# EAGLE design OwlRack (EAGLE 7.5.0)
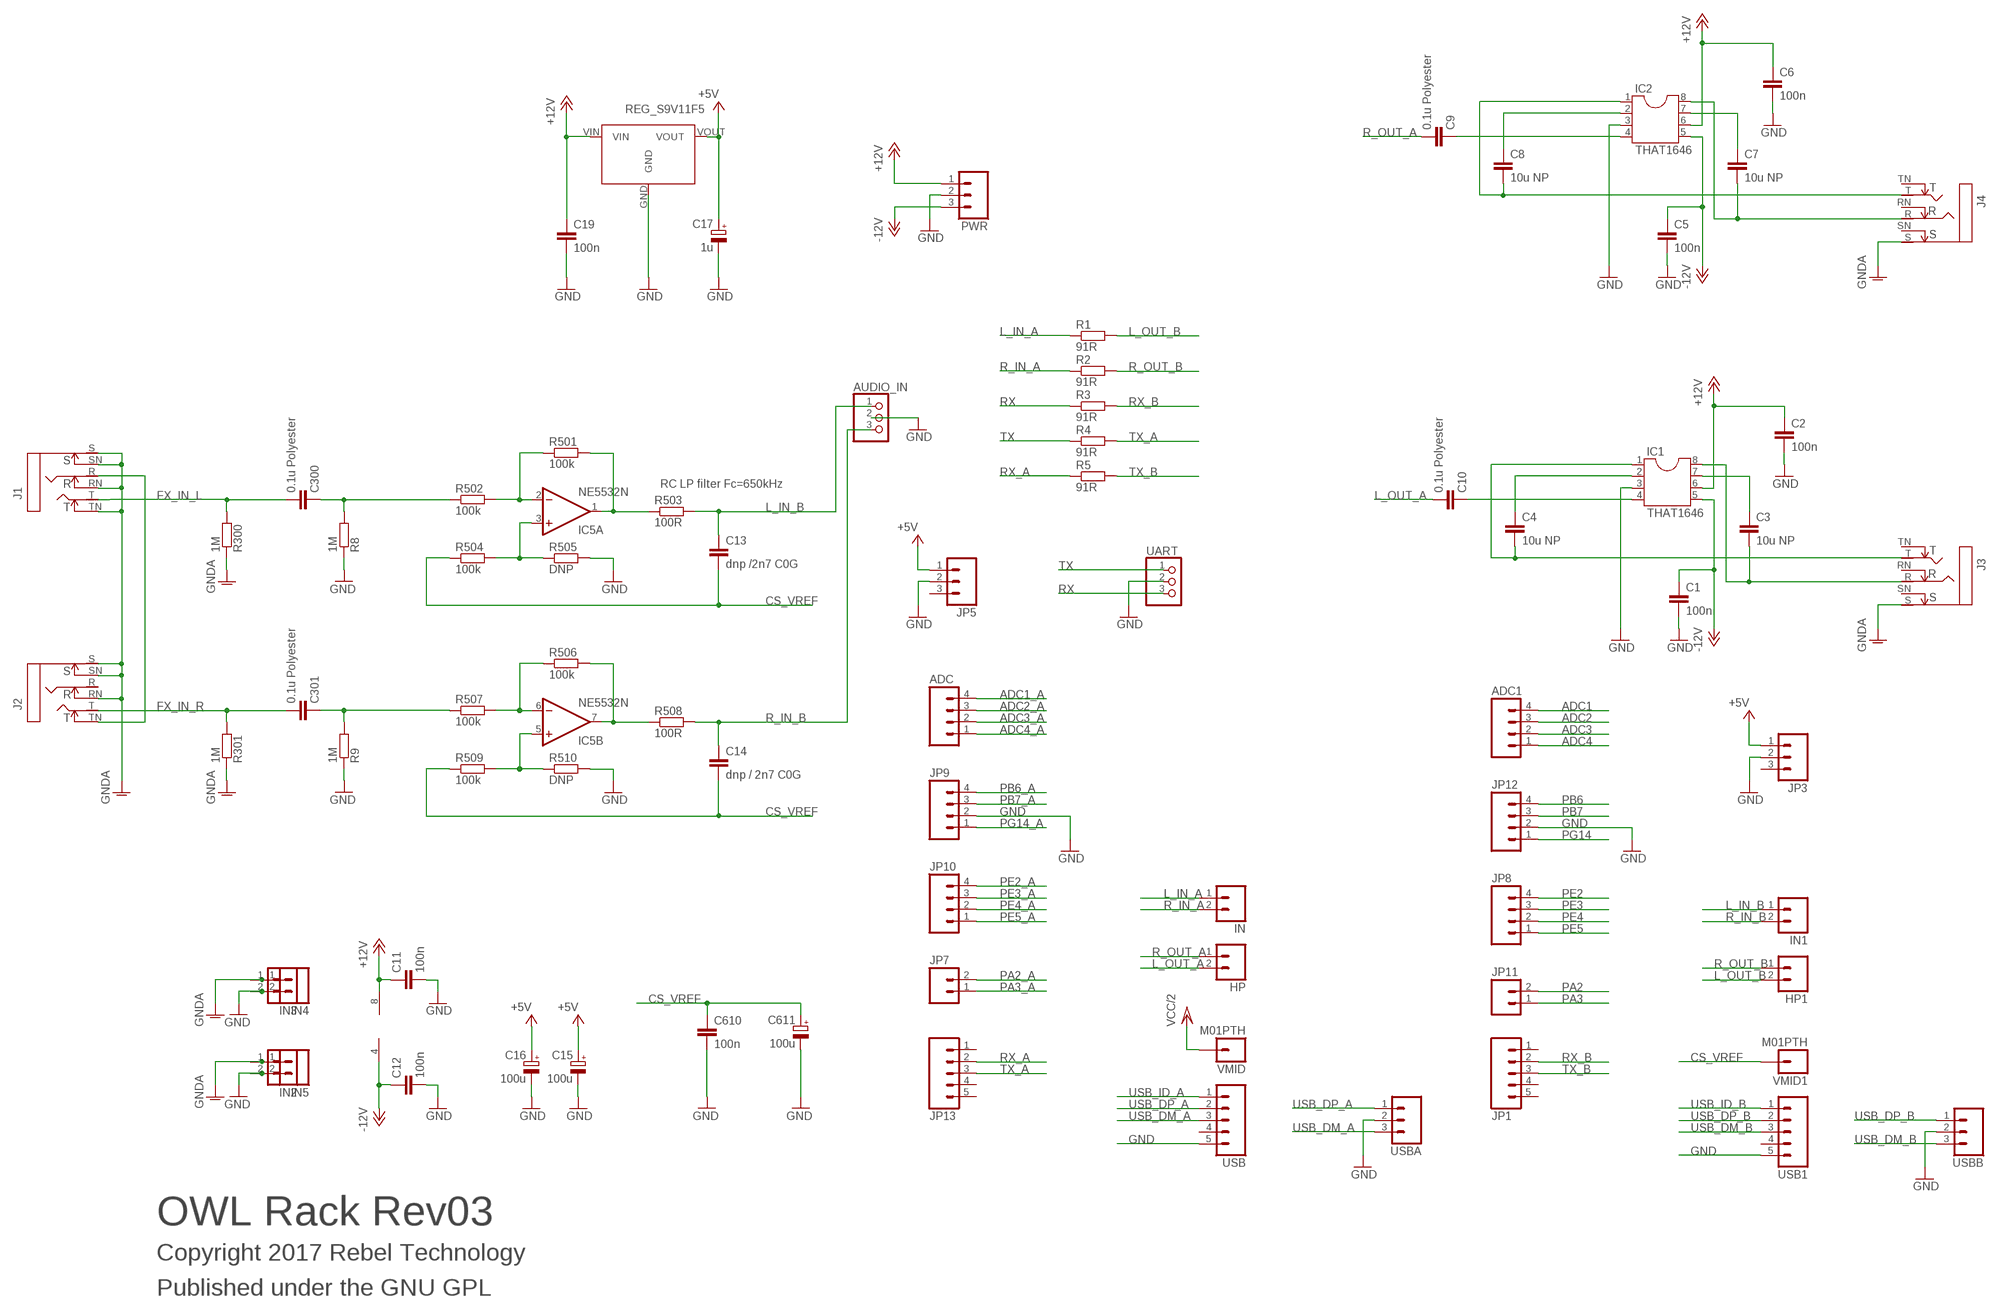
[diagram p0: schematic, sheet 1]

## Parts
ADC  M04PTH  [1X04]
ADC1  M04PTH  [1X04]
AUDIO_IN  CON-JST-1X03PH-TH  [JST-B3B-PH-KL]
C1  100n  C-EU050-025X075  [C050-025X075]
C2  100n  C-EU050-025X075  [C050-025X075]
C3  10u NP  C-EU050-025X075  [C050-025X075]
C4  10u NP  C-EU050-025X075  [C050-025X075]
C5  100n  C-EU050-025X075  [C050-025X075]
C6  100n  C-EU050-025X075  [C050-025X075]
C7  10u NP  C-EU050-025X075  [C050-025X075]
C8  10u NP  C-EU050-025X075  [C050-025X075]
C9  0.1u Polyester  C5/3.5  [C5B3.5]
C10  0.1u Polyester  C5/3.5  [C5B3.5]
C11  100n  C-EU050-025X075  [C050-025X075]
C12  100n  C-EU050-025X075  [C050-025X075]
C13  dnp /2n7 C0G  C-EU050-025X075  [C050-025X075]
C14  dnp / 2n7 C0G  C-EU050-025X075  [C050-025X075]
C15  100u  CPOL-EUE2.5-7  [E2,5-7]
C16  100u  CPOL-EUE2.5-7  [E2,5-7]
C17  1u  CPOL-EUE2.5-7  [E2,5-7]
C19  100n  C-EU050-025X075  [C050-025X075]
C300  0.1u Polyester  C5/3.5  [C5B3.5]
C301  0.1u Polyester  C5/3.5  [C5B3.5]
C610  100n  C-EU050-025X075  [C050-025X075]
C611  100u  CPOL-EUE2.5-7  [E2,5-7]
HP  M02PTH  [1X02]
HP1  M02PTH  [1X02]
IC1  THAT1646  DIL8  [DIL08]
IC2  THAT1646  DIL8  [DIL08]
IC3  REG_S9V11F5  [REG_S9V11F5]
IC5  NE5532N  [DIL08]
IN  M02PTH  [1X02]
IN1  M02PTH  [1X02]
IN2  M02PTH  [1X02]
IN3  M02PTH  [1X02]
IN4  M02PTH  [1X02]
IN5  M02PTH  [1X02]
J1  NEUTRIK_NRJ6HFSTD  [NRJ6HF]
J2  NEUTRIK_NRJ6HFSTD  [NRJ6HF]
J3  NEUTRIK_NRJ6HFSTD  [NRJ6HF]
J4  NEUTRIK_NRJ6HFSTD  [NRJ6HF]
JP1  M05PTH  [1X05]
JP3  M03PTH  [1X03]
JP5  M03PTH  [1X03]
JP7  M02PTH  [1X02]
JP8  M04PTH  [1X04]
JP9  M04PTH  [1X04]
JP10  M04PTH  [1X04]
JP11  M02PTH  [1X02]
JP12  M04PTH  [1X04]
JP13  M05PTH  [1X05]
PWR  M03PTH  [1X03]
R1  91R  R-EU_0204/7  [0204/7]
R2  91R  R-EU_0204/7  [0204/7]
R3  91R  R-EU_0204/7  [0204/7]
R4  91R  R-EU_0204/7  [0204/7]
R5  91R  R-EU_0204/7  [0204/7]
R8  1M  R-EU_0204/7  [0204/7]
R9  1M  R-EU_0204/7  [0204/7]
R300  1M  R-EU_0204/7  [0204/7]
R301  1M  R-EU_0204/7  [0204/7]
R501  100k  R-EU_0204/7  [0204/7]
R502  100k  R-EU_0204/7  [0204/7]
R503  100R  R-EU_0204/7  [0204/7]
R504  100k  R-EU_0204/7  [0204/7]
R505  DNP  R-EU_0204/7  [0204/7]
R506  100k  R-EU_0204/7  [0204/7]
R507  100k  R-EU_0204/7  [0204/7]
R508  100R  R-EU_0204/7  [0204/7]
R509  100k  R-EU_0204/7  [0204/7]
R510  DNP  R-EU_0204/7  [0204/7]
UART  CON-JST-1X03PH-TH  [JST-B3B-PH-KL]
USB  M05PTH  [1X05]
USB1  M05PTH  [1X05]
USBA  M03PTH  [1X03]
USBB  M03PTH  [1X03]
VMID  M01PTH  [1X01]
VMID1  M01PTH  [1X01]

## Nets
+5V: C15.+ C16.+ C17.+ IC3.VOUT JP3.1 JP5.1
+12V: C2.1 C6.1 C11.1 C19.1 IC1.6 IC2.6 IC3.VIN IC5.8(P:V+) PWR.1
-12V: C1.1 C5.1 C12.1 IC1.5 IC2.5 IC5.4(P:V-) PWR.3
ADC1: ADC1.4
ADC1_A: ADC.4
ADC2: ADC1.3
ADC2_A: ADC.3
ADC3: ADC1.2
ADC3_A: ADC.2
ADC4: ADC1.1
ADC4_A: ADC.1
CS_VREF: C13.2 C14.2 C610.1 C611.+ R504.1 R509.1 VMID1.1
FX_IN_L: C300.2 J1.T R300.2
FX_IN_R: C301.2 J2.T R301.2
GND: AUDIO_IN.2 C1.2 C2.2 C5.2 C6.2 C11.2 C12.2 C15.- C16.- C17.- C19.2 C610.2 C611.- IC1.3 IC2.3 IC3.GND IN2.2 IN3.2 IN4.2 IN5.2 JP3.2 JP5.2 JP9.2 JP12.2 PWR.2 R8.1 R9.1 R505.2 R510.2 UART.2 USB1.5 USB.5 USBA.2 USBB.2
GNDA: IN2.1 IN3.1 IN4.1 IN5.1 J1.RN J1.S J1.SN J1.TN J2.RN J2.S J2.SN J3.S J4.S R300.1 R301.1
L_IN_A: IN.1 R1.1
L_IN_B: AUDIO_IN.1 C13.1 IN1.1 R503.2
L_OUT_A: C10.2 HP.2
L_OUT_B: HP1.2 R1.2
N$1: IC5.7(B:OUT) R506.2 R508.1
N$2: C3.2 IC1.8 J3.R
N$3: C4.2 IC1.1 J3.T
N$4: C3.1 IC1.7
N$5: C4.1 IC1.2
N$6: J1.R J2.TN
N$7: C9.1 IC2.4
N$8: C7.1 IC2.7
N$9: C10.1 IC1.4
N$10: C8.1 IC2.2
N$18: C7.2 IC2.8 J4.R
N$19: C8.2 IC2.1 J4.T
N$26: C300.1 R8.2 R502.1
N$30: C301.1 R9.2 R507.1
N$36: IC5.3(A:+IN) R504.2 R505.1
N$38: IC5.2(A:-IN) R501.1 R502.2
N$40: IC5.1(A:OUT) R501.2 R503.1
N$42: IC5.5(B:+IN) R509.2 R510.1
N$43: IC5.6(B:-IN) R506.1 R507.2
PA2: JP11.2
PA2_A: JP7.2
PA3: JP11.1
PA3_A: JP7.1
PB6: JP12.4
PB6_A: JP9.4
PB7: JP12.3
PB7_A: JP9.3
PE2: JP8.4
PE2_A: JP10.4
PE3: JP8.3
PE3_A: JP10.3
PE4: JP8.2
PE4_A: JP10.2
PE5: JP8.1
PE5_A: JP10.1
PG14: JP12.1
PG14_A: JP9.1
R_IN_A: IN.2 R2.1
R_IN_B: AUDIO_IN.3 C14.1 IN1.2 R508.2
R_OUT_A: C9.2 HP.1
R_OUT_B: HP1.1 R2.2
RX: R3.1 UART.3
RX_A: JP13.2 R5.1
RX_B: JP1.2 R3.2
TX: R4.1 UART.1
TX_A: JP13.3 R4.2
TX_B: JP1.3 R5.2
USB_DM_A: USB.3 USBA.3
USB_DM_B: USB1.3 USBB.3
USB_DP_A: USB.2 USBA.1
USB_DP_B: USB1.2 USBB.1
USB_ID_A: USB.1
USB_ID_B: USB1.1
VCC/2: VMID.1
Unconnected: J2.R J3.RN J3.SN J3.TN J4.RN J4.SN J4.TN JP1.1 JP1.4 JP1.5 JP3.3 JP5.3 JP13.1 JP13.4 JP13.5 USB1.4 USB.4

## Notes on the sheet
- RC LP filter Fc=650kHz
- OWL Rack Rev03
- Copyright 2017 Rebel Technology
- Published under the GNU GPL

## Library data of the parts
ADC ADC1 JP8-JP10 JP12 = SparkFun:M04: Header 4 Standard 4-pin 0.1" header. Use with straight break away headers (SKU : PRT-00116), right angle break away headers (PRT-00553), swiss pins (PRT-00743), machine pins (PRT-00117), and female headers (PRT-00115). Molex polarized connector foot print use with SKU : PRT-08231 with associated crimp pins and housings. 1MM SMD Version SKU: PRT-10208
AUDIO_IN UART = Rebel:CON-JST-1X03
C1-C8 C11-C14 C19 C610 = rcl:C-EU: CAPACITOR, European symbol
C9 C10 C300 C301 = capacitor-wima:C: CAPACITOR naming: grid - package width
C15-C17 C611 = rcl:CPOL-EU: POLARIZED CAPACITOR, European symbol
HP HP1 IN IN1-IN5 JP7 JP11 = SparkFun:M02: Header 2 Standard 2-pin 0.1" header. Use with straight break away headers (SKU : PRT-00116), right angle break away headers (PRT-00553), swiss pins (PRT-00743), machine pins (PRT-00117), and female headers (PRT-00115). Molex polarized connector foot print use with SKU : PRT-08233 with associated crimp pins and housings.
IC1 IC2 = ic-package:DIL8: Dual In Line / Socket
IC3 = Rebel:REG_S9V11F5
IC5 = linear:NE5532: AUDIO AMPLIFIER
J1-J4 = neutrik_jacks:NEUTRIK_NRJ6HF
JP1 JP13 USB USB1 = SparkFun:M05: Header 5 Standard 5-pin 0.1" header. Use with straight break away headers (SKU : PRT-00116), right angle break away headers (PRT-00553), swiss pins (PRT-00743), machine pins (PRT-00117), and female headers (PRT-00115). Molex polarized connector foot print use with SKU : PRT-08230 with associated crimp pins and housings.
JP3 JP5 PWR USBA USBB = SparkFun:M03: Header 3 Standard 3-pin 0.1" header. Use with straight break away headers (SKU : PRT-00116), right angle break away headers (PRT-00553), swiss pins (PRT-00743), machine pins (PRT-00117), and female headers (PRT-00115). Molex polarized connector foot print use with SKU : PRT-08232 with associated crimp pins and housings.
R1-R5 R8 R9 R300 R301 R501-R510 = Rebel:R-EU_: RESISTOR, European symbol
VMID VMID1 = SparkFun:M01: Header 1 Standard 1-pin 0.1" header. Use with straight break away headers (SKU : PRT-00116), right angle break away headers (PRT-00553), swiss pins (PRT-00743), machine pins (PRT-00117), and female headers (PRT-00115).

## Board
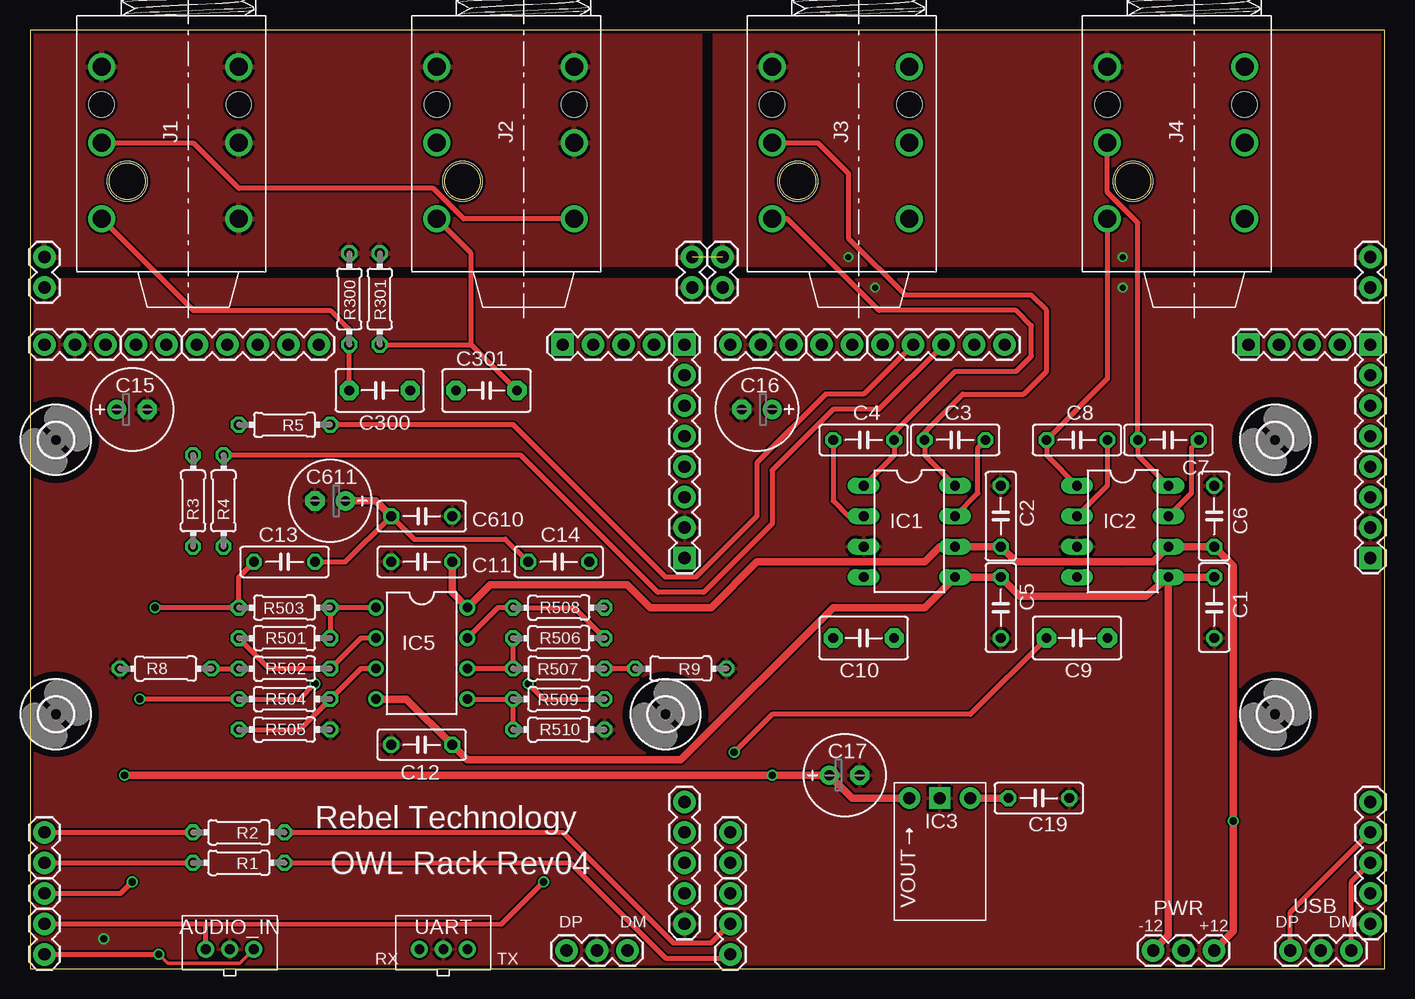
[diagram p1: board, top side]
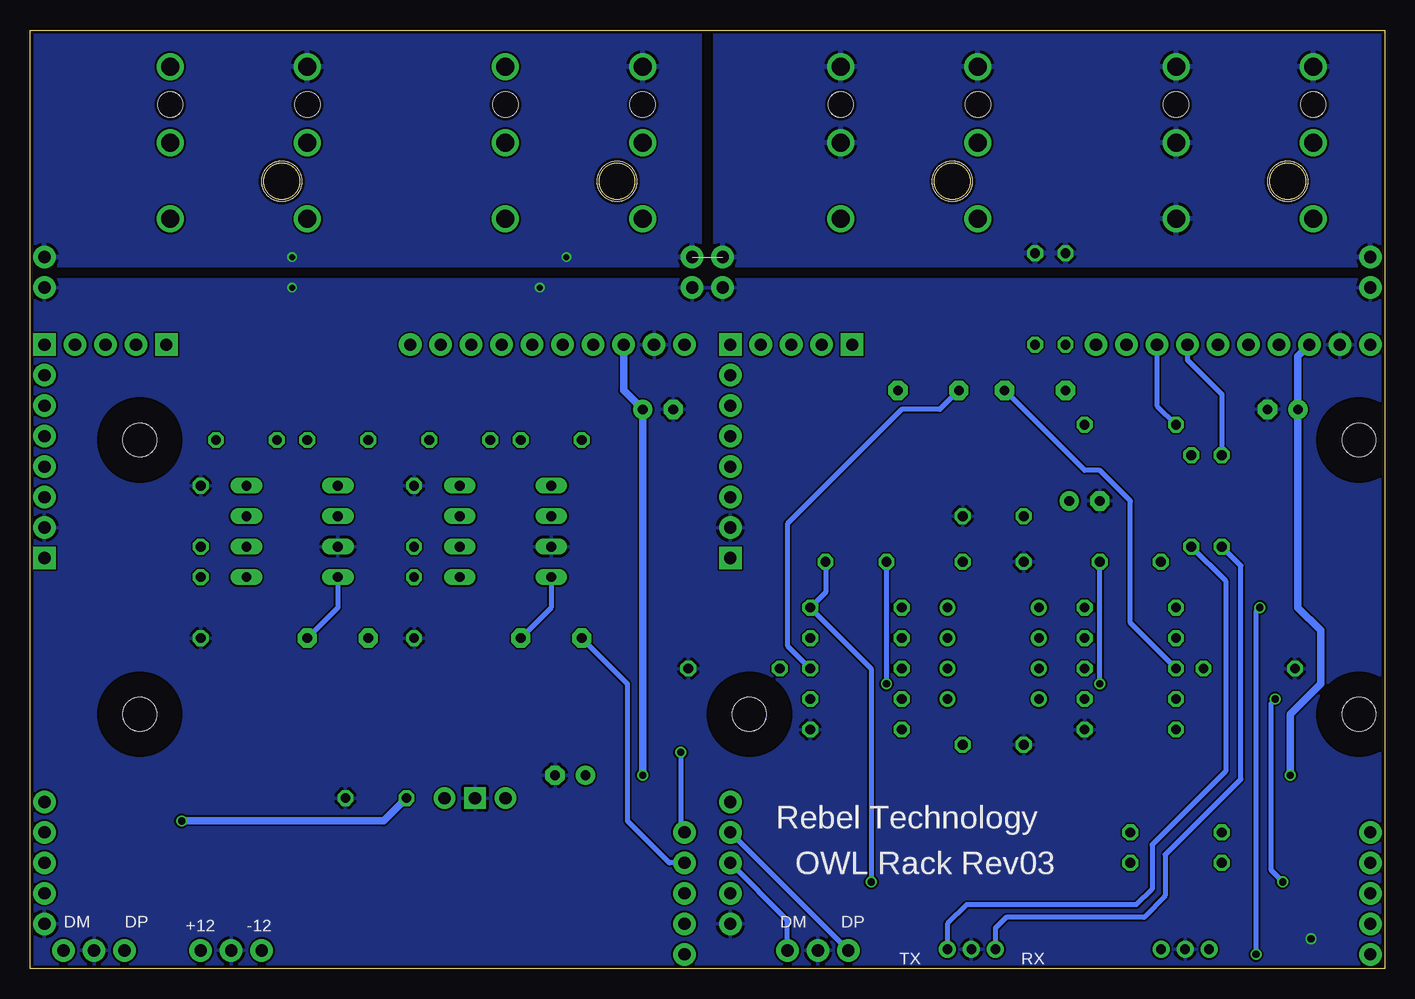
[diagram p2: board, bottom side, seen from below]

Size 112.9 x 78.23 mm. Coordinates in mm from the lower left corner, seen from the top.
Outline: 0,0 112.9,0 112.9,78.23 0,78.23 0,0
Copper layers (1*16): Top 0.035mm / dielectric 1.5mm / Bottom 0.035mm
Design rules "SeeedStudio_2layer_DRU_no_angle_20140221": minimum track width 6mil, minimum drill 12mil, track to track 6mil, track to pad 6mil, pad to pad 6mil, via to via 6mil, smd to smd 0mil, copper to edge 10mil, drill to drill 10mil, minimum pad ring 10mil, minimum via ring 6mil, stop-mask expansion 2mil, vias tented up to drill 100mil, thermal gap 10mil

### Footprints (pad centres in the part's own frame; a part is rotated, then mirrored left to right if it is on the bottom)
1X04 = drill 1.016 pad 1.88 square: 1 0,0 | drill 1.016 pad 1.88: 2 2.54,0; 3 5.08,0; 4 7.62,0
JST-B3B-PH-KL = drill 0.8 pad 1.422: 1 2,0; 2 0,0; 3 -2,0
C050-025X075 = drill 0.813 octagon: 1 -2.54,0; 2 2.54,0
C5B3.5 = drill 0.813 pad 1.6 octagon: 1 -2.54,0; 2 2.54,0
E2,5-7 = drill 0.813 pad 1.6: + -1.27,0 | drill 0.813 pad 1.6 octagon: - 1.27,0
1X02 = drill 1.016 pad 1.88: 1 0,0; 2 2.54,0
DIL08 = drill 0.813 long: 1 -3.81,-3.81; 2 -1.27,-3.81; 3 1.27,-3.81; 4 3.81,-3.81; 5 3.81,3.81; 6 1.27,3.81; 7 -1.27,3.81; 8 -3.81,3.81
REG_S9V11F5 = drill 1.016 pad 1.778 square: GND 0,0 | drill 1.016 pad 1.778: VIN -2.54,0; VOUT 2.54,0
DIL08' = drill 0.813 pad 1.27: 1 -3.81,-3.81; 2 -1.27,-3.81; 3 1.27,-3.81; 4 3.81,-3.81; 5 3.81,3.81; 6 1.27,3.81; 7 -1.27,3.81; 8 -3.81,3.81
NRJ6HF = drill 1.5: R 0,6.35; RN 0,-5.08; S 6.35,6.35; SN 6.35,-5.08; T -6.35,6.35; TN -6.35,-5.08 | hole 2.1: 3.175,6.35; 3.175,-5.08 | hole 3.3: -3.2,4.219
1X05 = drill 1.016 pad 1.88: 1 0,0; 2 2.54,0; 3 5.08,0; 4 7.62,0; 5 10.16,0
1X03 = drill 1.016 pad 1.88: 1 0,0; 2 2.54,0; 3 5.08,0
0204/7 = drill 0.813 octagon: 1 -3.81,0; 2 3.81,0
2,8 = hole 2.8: 0,0
1X01 = drill 1.016 pad 1.88: 1 0,0

### Placement (x,y rotation side)
ADC  111.7,52.01 270 top
ADC1  54.55,52.01 270 top
AUDIO_IN  16.65,1.62 0 top
C1  98.68,30.1 270 top
C2  80.9,37.72 90 top
C3  77.09,44.07 180 top
C4  69.47,44.07 0 top
C5  80.9,30.1 270 top
C6  98.68,37.72 90 top
C7  94.87,44.07 180 top
C8  87.25,44.07 180 top
C9  87.25,27.56 180 top
C10  69.47,27.56 180 top
C11  32.64,33.91 180 top
C12  32.64,18.67 180 top
C13  21.21,33.91 0 top
C14  44.07,33.91 180 top
C15  8.51,46.61 0 top
C16  60.58,46.61 180 top
C17  67.88,16.13 0 top
C19  84.07,14.22 0 top
C300  29.15,48.2 180 top
C301  38.04,48.2 0 top
C610  32.64,37.72 0 top
C611  25.02,38.99 180 top
HP  58.36,11.37 270 top
HP1  1.21,11.37 270 top
IC1  73.28,36.45 270 top
IC2  91.06,36.45 270 top
IC3  75.82,14.22 180 top
IC5  NE5532N  [DIL08']  32.64,26.29 270 top
IN  58.36,1.21 90 top
IN1  1.21,1.21 90 top
IN2  55.18,59.31 270 top
IN3  57.72,59.31 270 top
IN4  1.21,59.31 270 top
IN5  111.7,59.31 270 top
J1  12.32,68.83 90 top
J2  40.26,68.83 90 top
J3  68.2,68.83 90 top
J4  96.14,68.83 90 top
JP1  13.91,52.01 0 top
JP3  6.29,52.01 180 top
JP5  63.44,52.01 180 top
JP7  65.98,52.01 0 top
JP8  44.39,52.01 0 top
JP9  111.7,34.23 90 top
JP10  101.54,52.01 0 top
JP11  8.83,52.01 0 top
JP12  54.55,34.23 90 top
JP13  71.06,52.01 0 top
PWR  98.68,1.52 180 top
R1  17.4,8.83 180 top
R2  17.4,11.37 180 top
R3  13.59,38.99 90 top
R4  16.13,38.99 90 top
R5  21.21,45.34 180 top
R8  11.3,25.02 0 top
R9  54.23,25.02 180 top
R300  26.61,55.82 270 top
R301  29.15,55.82 270 top
R501  21.21,27.56 0 top
R502  21.21,25.02 0 top
R503  21.21,30.1 180 top
R504  21.21,22.48 0 top
R505  21.21,19.94 0 top
R506  44.07,27.56 0 top
R507  44.07,25.02 180 top
R508  44.07,30.1 0 top
R509  44.07,22.48 180 top
R510  44.07,19.94 0 top
U$1  [2,8]  52.96,21.21 0 top
U$3  [2,8]  103.76,21.21 0 top
U$4  [2,8]  2.16,21.21 0 top
U$5  [2,8]  2.16,44.07 0 top
U$6  [2,8]  103.76,44.07 0 top
UART  34.45,1.62 0 top
USB  111.7,13.91 270 top
USB1  54.55,13.91 270 top
USBA  105.03,1.52 0 top
USBB  44.7,1.52 0 top
VMID  58.36,6.29 270 top
VMID1  1.21,6.29 180 top

### Tracks (layer width: path | path; a pad name or v marks a point on that pad's centre or on a via)
+5V  (via drill 0.6)
  Top 0.61: v7.87,16.13 v61.85,16.13 67.25,16.13 C17.+ 68.52,14.22 IC3.VOUT
  Bottom 0.61: JP3.1 7.24,51.05 C15.+ 7.24,30.1 5.33,28.19 5.33,23.75 7.87,21.21 v7.87,16.13 | JP5.1 63.44,48.2 C16.+ v61.85,16.13
+12V  (via drill 0.6)
  Top 0.61: C11.1 35.18,31.37 IC5.8 38.35,32 49.78,32 51.69,30.1 56.77,30.1 60.58,33.91 74.55,33.91 75.82,35.18 IC1.6 C2.1 82.17,33.91 91.06,33.91 93.6,33.91 IC2.6 C6.1 100.27,33.59 v100.27,12.32 100.27,3.11 PWR.1 | C19.1 IC3.VIN
  Bottom 0.61: C19.1 83.44,12.32 v100.27,12.32
-12V
  Top 0.61: IC2.5 C1.1 | IC2.5 92.96,31.05 82.49,31.05 C5.1 IC1.5 74.55,30.1 66.93,30.1 54.23,17.4 36.45,17.4 C12.1 31.37,22.48 IC5.4 | PWR.3 94.87,2.79 IC2.5
CS_VREF  (via drill 0.6)
  Top 0.406: v23.75,23.75 22.48,22.48 R504.1 v9.14,22.48 | v41.53,23.75 42.8,22.48 R509.1 | VMID1.1 7.56,6.29 v8.51,7.24 | C13.2 26.29,33.91 C610.1 32,35.81 39.62,35.81 C14.2
  Top 0.61: C611.+ 28.83,38.99 C610.1
  Bottom 0.406: v23.75,23.75 C13.2 | C14.2 v41.53,23.75 | v8.51,7.24 9.46,8.19 9.46,22.16 v9.14,22.48
FX_IN_L
  Top 0.406: J1.T 13.59,54.86 25.02,54.86 26.29,53.59 26.61,53.28 R300.2 C300.2
FX_IN_R
  Top 0.406: R301.2 36.77,52.01 | 36.77,52.01 C301.2 | 36.77,52.01 36.77,59.63 J2.T
GND  (via drill 0.5, 0.6)
  other vias: 70.42,56.77 91.06,56.77 6.15,2.49
  pour Bottom: -9.27,-14.35 -9.27,57.4 117.41,57.4 117.41,-14.35
  pour Top: -9.27,-14.35 -9.27,57.4 117.41,57.4 117.41,-14.35
GNDA  (via drill 0.5)  (1 unrouted)
  other vias: 68.2,59.31 91.06,59.31
  pour Bottom: 57.09,58.67 57.09,80.26 117.73,80.26 117.73,58.67
  pour Top: 57.09,58.67 57.09,80.26 117.73,80.26 117.73,58.67
  pour Top: -13.08,58.67 -13.08,80.26 55.82,80.26 55.82,58.67
  pour Bottom: -13.08,58.67 -13.08,80.26 55.82,80.26 55.82,58.67
L_IN_A
  Top 0.406: R1.1 45.02,8.83 52.96,0.89 58.04,0.89 IN.1
L_IN_B  (via drill 0.6)
  Top 0.305: AUDIO_IN.1 17.47,0.44 11.49,0.44 v10.73,1.21
  Top 0.406: IN1.1 8.83,1.21 v10.73,1.21 | C13.1 17.4,32.64 R503.2 v10.41,30.1
  Bottom 0.406: v10.73,1.21 10.73,3.11 10.73,29.78 v10.41,30.1
L_OUT_A
  Bottom 0.406: C10.2 63.12,23.75 63.12,12.32 59.63,8.83 HP.2
L_OUT_B
  Top 0.406: HP1.2 R1.2
N$1
  Top 0.406: IC5.7 38.99,30.1 R508.1 45.34,30.1 R506.2
N$2
  Top 0.406: IC1.8 74.55,42.8 C3.2 74.55,44.7 77.72,47.88 82.8,47.88 84.71,49.78 84.71,54.86 83.44,56.13 72.96,56.13 68.2,60.9 68.2,66.29 65.66,68.83 J3.R
N$3
  Top 0.406: IC1.1 72.01,42.8 C4.2 72.01,44.7 77.09,49.78 82.17,49.78 83.44,51.05 83.44,53.59 82.17,54.86 70.74,54.86 63.12,62.48 J3.T
N$4
  Top 0.406: IC1.7 78.99,39.62 78.99,43.43 C3.1
N$5
  Top 0.406: C4.1 66.93,38.99 68.2,37.72 IC1.2
N$6
  Top 0.406: J1.R 13.59,68.83 16.13,66.29 17.4,65.02 33.59,65.02 36.13,62.48 J2.TN
N$7
  Bottom 0.406: IC2.4 87.25,30.1 C9.1
N$8
  Top 0.406: C7.1 96.77,43.43 96.77,39.62 IC2.7
N$9
  Bottom 0.406: IC1.4 69.47,30.1 C10.1
N$10
  Top 0.406: C8.1 89.79,40.26 IC2.2
N$18
  Top 0.406: IC2.8 92.33,42.8 C7.2 92.33,62.17 89.79,64.71 J4.R
N$19
  Top 0.406: IC2.1 84.71,42.8 C8.2 89.79,49.15 J4.T
N$26
  Top 0.406: R8.2 R502.1
  Bottom 0.406: C300.1 25.02,41.53 23.75,41.53 21.21,38.99 21.21,28.83 R502.1
N$30
  Top 0.406: R9.2 R507.1
  Bottom 0.406: C301.1 37.08,46.61 40.26,46.61 49.78,37.08 49.78,26.92 R507.1
N$36
  Top 0.406: IC5.3 27.56,25.02 R504.2 22.48,19.94 R505.1
N$38
  Top 0.406: IC5.2 27.56,27.56 R502.2 19.94,25.02 R501.1
N$40
  Top 0.406: IC5.1 R503.1 R501.2
N$42
  Top 0.406: IC5.5 R509.2 R510.1
N$43
  Top 0.406: IC5.6 R507.2 R506.1
R_IN_A
  Top 0.406: R2.1 44.39,11.37 53.59,2.16 56.77,2.16 IN.2
R_IN_B  (via drill 0.6)
  Top 0.406: IN1.2 14.67,3.75 | 14.67,3.75 39.29,3.72 41.53,5.97 v42.8,7.24 | AUDIO_IN.3 14.65,3.73 14.67,3.75
  Bottom 0.406: C14.1 46.61,31.37 R508.2 42.8,25.02 v42.8,7.24
R_OUT_A  (via drill 0.6)
  Top 0.406: C9.2 78.36,21.21 61.85,21.21 v58.67,18.03
  Bottom 0.406: v58.67,18.03 58.67,11.68 HP.1
R_OUT_B
  Top 0.406: HP1.1 R2.2
RX
  Bottom 0.406: R3.1 12,33.59 12,15.81 18.3,9.51 18.3,6.09 20.05,4.29 31.55,4.29 32.45,3.39 UART.3
RX_A
  Top 0.406: JP13.2 69.47,47.88 66.29,47.88 60.58,42.16 60.58,37.72 55.5,32.64 52.96,32.64 40.26,45.34 R5.1
RX_B
  Bottom 0.406: JP1.2 16.45,50.74 13.59,47.88 R3.2
TX
  Bottom 0.406: R4.1 13.27,32.32 13.27,16.45 19.4,10.32 19.4,6.64 20.7,5.34 34.85,5.34 36.45,3.74 UART.1
TX_A
  Top 0.406: JP13.3 70.74,46.61 66.93,46.61 61.85,41.53 61.85,37.08 56.13,31.37 52.32,31.37 40.89,42.8 R4.2
TX_B
  Bottom 0.406: JP1.3 18.99,46.93 R5.2
USB_DM_A
  Top 0.406: USBA.3 110.11,7.24 USB.3
USB_DM_B
  Bottom 0.406: USBB.3 49.78,4.06 USB1.3
USB_DP_A
  Top 0.406: USBA.1 105.03,4.7 USB.2
USB_DP_B
  Bottom 0.406: USBB.1 USB1.2

### Text on the board
tPlace: Rebel Technology | OWL Rack Rev04 | DP | DM | -12 | +12 | DP | DM | RX | TX
bPlace: Rebel Technology | OWL Rack Rev03 | DP | DM | -12 | +12 | DP | DM | RX | TX